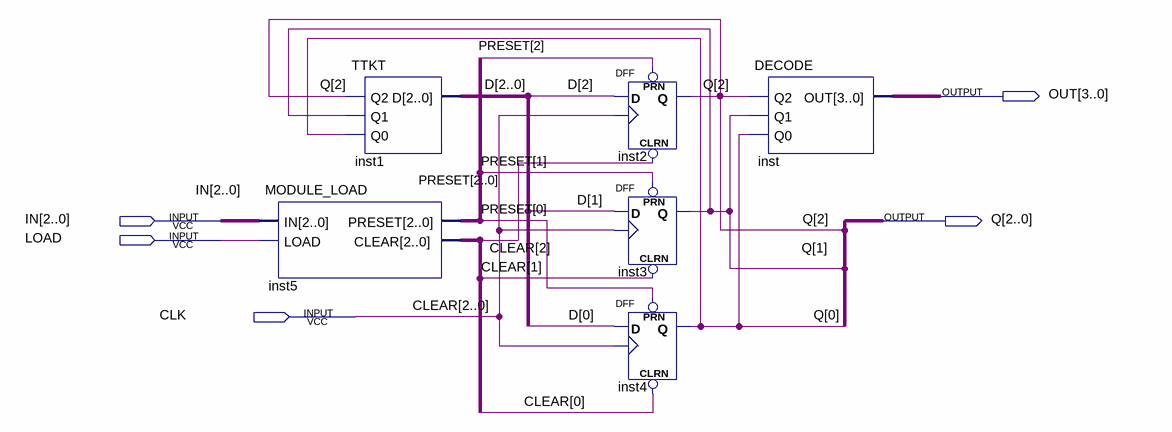
[diagram p0: schematic sheet]
// Quartus schematic DEM_DONG_BO.bdf as structural Verilog: 6 symbols, 5 pins
module DEM_DONG_BO (
  input  [2:0] IN,
  input  LOAD,
  input  CLK,
  output [3:0] OUT,
  output [2:0] Q
);

  wire [2:0] CLEAR, D, PRESET;

  MODULE_LOAD inst5 (.IN(IN), .LOAD(LOAD), .PRESET(PRESET), .CLEAR(CLEAR));
  TTKT inst1 (.Q2(Q[2]), .Q1(Q[1]), .Q0(Q[0]), .D(D));
  DFF inst2 (.CLRN(CLEAR[2]), .CLK(CLK), .D(D[2]), .PRN(PRESET[2]), .Q(Q[2]));
  DFF inst3 (.CLRN(CLEAR[1]), .CLK(CLK), .D(D[1]), .PRN(PRESET[1]), .Q(Q[1]));
  DFF inst4 (.CLRN(CLEAR[0]), .CLK(CLK), .D(D[0]), .PRN(PRESET[0]), .Q(Q[0]));
  DECODE inst (.Q2(Q[2]), .Q1(Q[1]), .Q0(Q[0]), .OUT(OUT));
endmodule
